# Altium schematic sheet Power.SchDoc
size A4
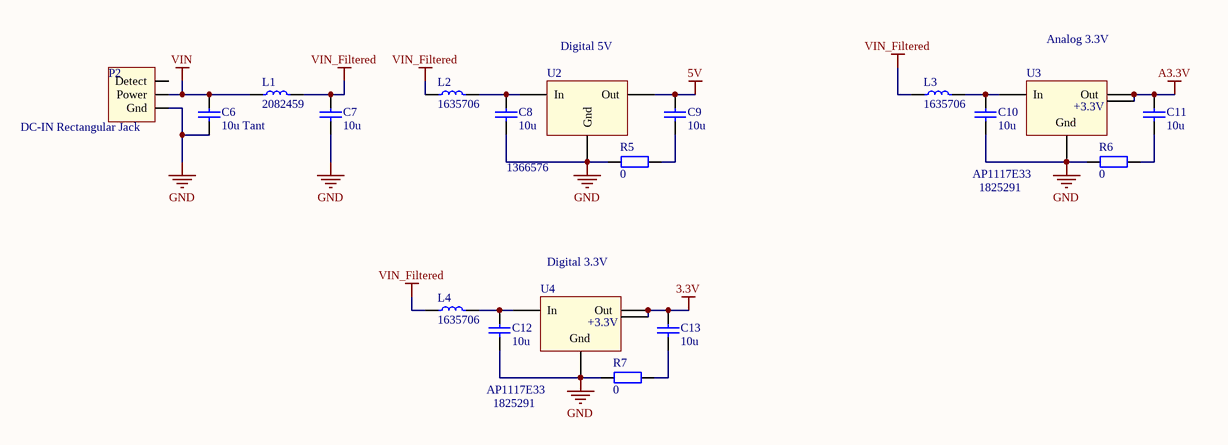
[diagram p0: Power.SchDoc]

## Parts
C6  10u Tant  [CAPC3216M]
C7  10u  [CAPC2012M]
C8  10u  [CAPC2012M]
C9  10u  [CAPC2012M]
C10  10u  [CAPC2012M]
C11  10u  [CAPC2012M]
C12  10u  [CAPC2012M]
C13  10u  [CAPC2012M]
L1  Supplier Part Number 1: 2082459  [WE_742792901]  (hidden comment: Wurth_742792901)
L2  Supplier Part Number 1: 1635706  [INDC1608M]  (hidden comment: FerriteBead_600R)
L3  Supplier Part Number 1: 1635706  [INDC1608M]  (hidden comment: FerriteBead_600R)
L4  Supplier Part Number 1: 1635706  [INDC1608M]  (hidden comment: FerriteBead_600R)
P2  DC-IN Rectangular Jack  [DC-IN-RECT-JACK-PCB]
R5  0  [RESC1608M]
R6  0  [RESC1608M]
R7  0  [RESC1608M]
U2  Supplier Part Number 1: 1366576  [D2PAK_M]  (hidden comment: L7805CD2T-TR)
U3  AP1117E33  Supplier Part Number 1: 1825291  [SOT223-4M]
U4  AP1117E33  Supplier Part Number 1: 1825291  [SOT223-4M]

## Nets
3.3V: C13.2 U4.Out U4.Out2
5V: C9.2 U2.Out
A3.3V: C11.2 U3.Out U3.Out2
GND: C6.2 C7.1 C8.1 C10.1 C12.1 P2.Gnd R5.2 R6.2 R7.2 U2.Gnd U3.Gnd U4.Gnd
VIN: C6.1 L1.1 P2.Power
VIN_Filtered: C7.2 L1.2 L2.1 L3.1 L4.1
NetC8_2: C8.2 L2.2 U2.In
NetC9_1: C9.1 R5.1
NetC10_2: C10.2 L3.2 U3.In
NetC11_1: C11.1 R6.1
NetC12_2: C12.2 L4.2 U4.In
NetC13_1: C13.1 R7.1

Not connected (* = marked no-connect by the designer): P2 Detect

## Notes on the sheet
- (near U2) Digital 5V
- Analog 3.3V
- (near U4) Digital 3.3V
- (in symbol AP1117E33) +3.3V

## Library data of the parts
C6-C13 = C
  C6: Value: 10u Tant
  C7-C13: Value: 10u
L1 = Wurth_742792901: Ferrite bead, 1.1k Ohm, 10A, (Wurth 742792901); Supplier 1: Farnell
L2-L4 = FerriteBead_600R: Ferrite bead,  600 Ohm, 1A; Supplier 1: Farnell
P2 = DC-IN Rectangular Jack: pin to pad: Detect>DETECT Gnd>GROUND Power>POWER; Supplier 1: Farnell; Supplier Part Number 1: 2507908
R5-R7 = R: Value: 0
U2 = L7805CD2T-TR: 5V 500mA linear regulator, D2PAK-3; pin to pad: Gnd>2 In>1 Out>3; Supplier 1: Farnell
U3 U4 = AP1117E33: 3.3V 1A LDO linear regulator; pin to pad: Gnd>1 In>3 Out>4 Out2>2; Supplier 1: Farnell